# Altium schematic sheet main.SchDoc
size A4
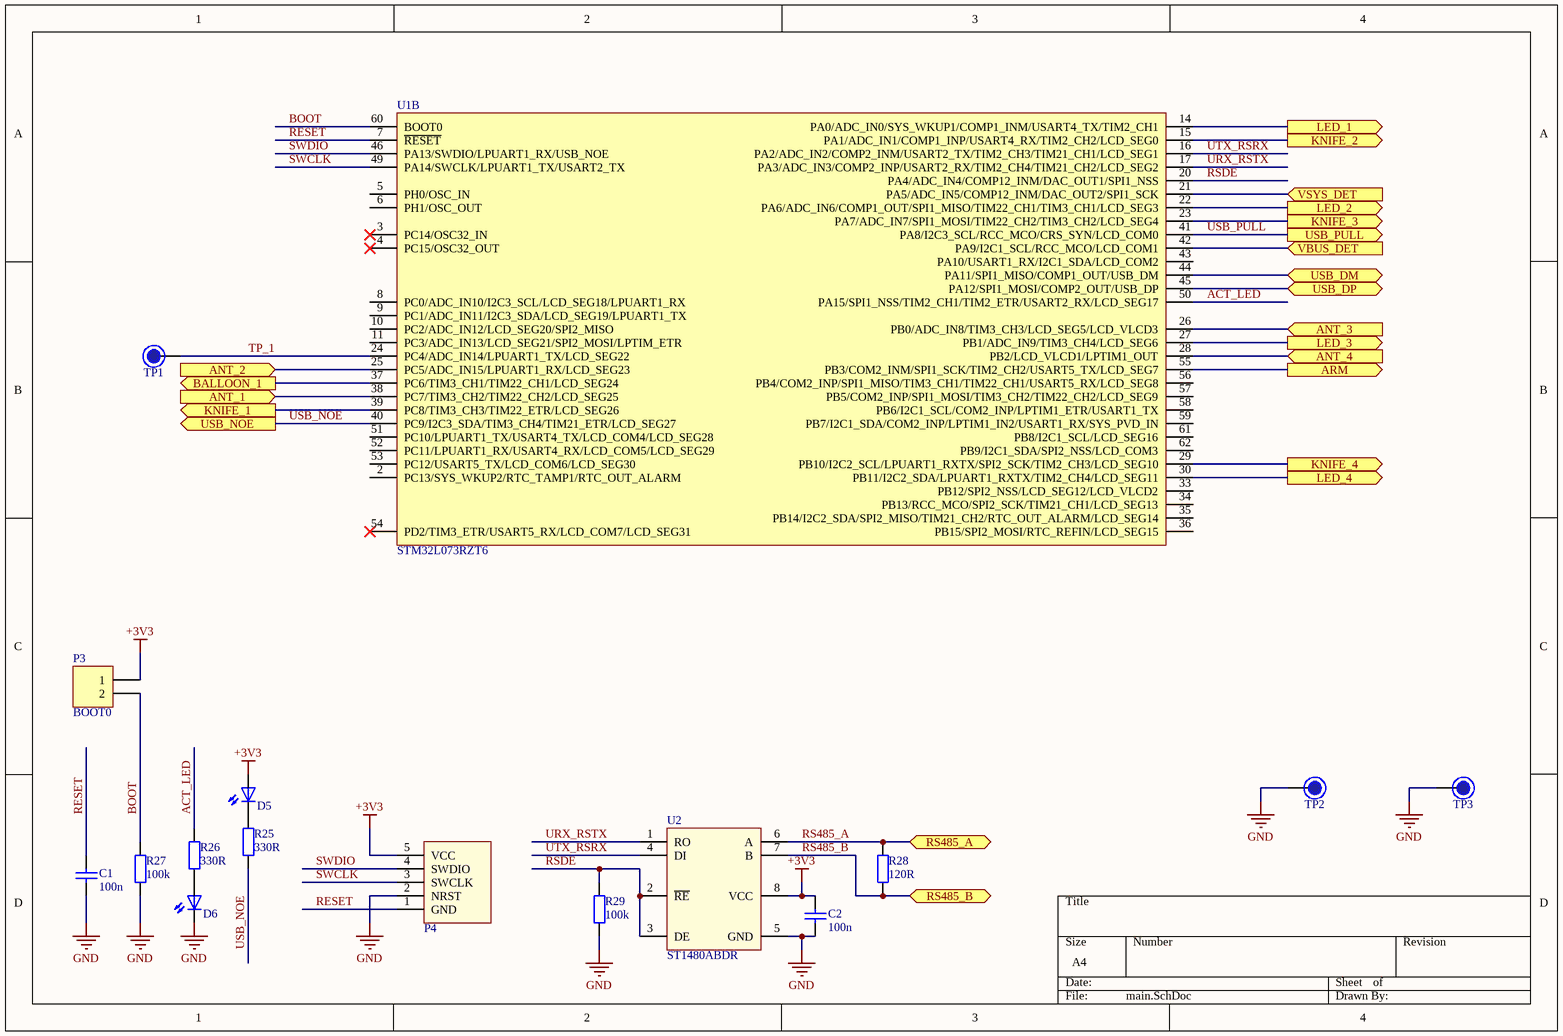
[diagram p0: main.SchDoc]

## Parts
C1  100n  [C0603_IPC_MD]
C2  100n  [C0603_IPC_MD]
D5  LTST-C190GKT  [LED_0603]  (value not drawn)
D6  LTST-C190GKT  [LED_0603]  (value not drawn)
P3  BOOT0  [HDR1X2]  (no BOM)
P4  SWD  [SWD_CON_VAR2]  (value not drawn)  (no BOM)
R25  330R  [R0603_IPC_MD]
R26  330R  [R0603_IPC_MD]
R27  100k  [R0603_IPC_MD]
R28  120R  [R0603_IPC_MD]
R29  100k  [R0603_IPC_MD]
TP1  Test Point  [TestPoint_1M5]  (value not drawn)  (no BOM)
TP2  GND  [TestPoint_1M5_TH]  (value not drawn)  (no BOM)
TP3  GND  [TestPoint_1M5_TH]  (value not drawn)  (no BOM)
U1  STM32L073RZT6  [LQFP64_10X10MM]  (part B of 2)
U2  ST1480ABDR  [SOIC-8]

## Ports
ANT_1 (in), ANT_2 (in), ANT_3 (in), ANT_4 (in), ARM (out), BALLOON_1 (out), KNIFE_1 (out), KNIFE_2 (out), KNIFE_3 (out), KNIFE_4 (out), LED_1 (out), LED_2 (out), LED_3 (out), LED_4 (out), RS485_A (bidir), RS485_B (bidir), USB_DM (bidir), USB_DP (bidir), USB_NOE (out), USB_PULL (out), VBUS_DET (in), VSYS_DET (in)

## Nets
+3V3: C2.2 D5.2(A) P3.1 P4.5(VCC) U2.8(VCC)
GND: C1.1 C2.1 D6.1(C) P4.2(NRST) R27.1 R29.1 TP2.0 TP3.0 U2.5(GND)
ACT_LED: R26.1 U1.50(PA15/SPI1_NSS/TIM2_CH1/TIM2_ETR/USART2_RX/LCD_SEG17)
ANT_1: U1.38(PC7/TIM3_CH2/TIM22_CH2/LCD_SEG25) ; port ANT_1
ANT_2: U1.25(PC5/ADC_IN15/LPUART1_RX/LCD_SEG23) ; port ANT_2
ANT_3: U1.26(PB0/ADC_IN8/TIM3_CH3/LCD_SEG5/LCD_VLCD3) ; port ANT_3
ANT_4: U1.28(PB2/LCD_VLCD1/LPTIM1_OUT) ; port ANT_4
ARM: U1.55(PB3/COM2_INM/SPI1_SCK/TIM2_CH2/USART5_TX/LCD_SEG7) ; port ARM
BALLOON_1: U1.37(PC6/TIM3_CH1/TIM22_CH1/LCD_SEG24) ; port BALLOON_1
BOOT: P3.2 R27.2 U1.60(BOOT0)
KNIFE_1: U1.39(PC8/TIM3_CH3/TIM22_ETR/LCD_SEG26) ; port KNIFE_1
KNIFE_2: U1.15(PA1/ADC_IN1/COMP1_INP/USART4_RX/TIM2_CH2/LCD_SEG0) ; port KNIFE_2
KNIFE_3: U1.23(PA7/ADC_IN7/SPI1_MOSI/TIM22_CH2/TIM3_CH2/LCD_SEG4) ; port KNIFE_3
KNIFE_4: U1.29(PB10/I2C2_SCL/LPUART1_RXTX/SPI2_SCK/TIM2_CH3/LCD_SEG10) ; port KNIFE_4
LED_1: U1.14(PA0/ADC_IN0/SYS_WKUP1/COMP1_INM/USART4_TX/TIM2_CH1) ; port LED_1
LED_2: U1.22(PA6/ADC_IN6/COMP1_OUT/SPI1_MISO/TIM22_CH1/TIM3_CH1/LCD_SEG3) ; port LED_2
LED_3: U1.27(PB1/ADC_IN9/TIM3_CH4/LCD_SEG6) ; port LED_3
LED_4: U1.30(PB11/I2C2_SDA/LPUART1_RXTX/TIM2_CH4/LCD_SEG11) ; port LED_4
RESET: C1.2 P4.1(GND) U1.7(~{RESET})
RS485_A: R28.2 U2.6(A) ; port RS485_A
RS485_B: R28.1 U2.7(B) ; port RS485_B
RSDE: R29.2 U1.20(PA4/ADC_IN4/COMP12_INM/DAC_OUT1/SPI1_NSS) U2.2(~{RE}) U2.3(DE)
SWCLK: P4.3(SWCLK) U1.49(PA14/SWCLK/LPUART1_TX/USART2_TX)
SWDIO: P4.4(SWDIO) U1.46(PA13/SWDIO/LPUART1_RX/USB_NOE)
TP_1: TP1.0 U1.24(PC4/ADC_IN14/LPUART1_TX/LCD_SEG22)
URX_RSTX: U1.17(PA3/ADC_IN3/COMP2_INP/USART2_RX/TIM2_CH4/TIM21_CH2/LCD_SEG2) U2.1(RO)
USB_DM: U1.44(PA11/SPI1_MISO/COMP1_OUT/USB_DM) ; port USB_DM
USB_DP: U1.45(PA12/SPI1_MOSI/COMP2_OUT/USB_DP) ; port USB_DP
USB_NOE: R25.2 U1.40(PC9/I2C3_SDA/TIM3_CH4/TIM21_ETR/LCD_SEG27) ; port USB_NOE
USB_PULL: U1.41(PA8/I2C3_SCL/RCC_MCO/CRS_SYN/LCD_COM0) ; port USB_PULL
UTX_RSRX: U1.16(PA2/ADC_IN2/COMP2_INM/USART2_TX/TIM2_CH3/TIM21_CH1/LCD_SEG1) U2.4(DI)
VBUS_DET: U1.42(PA9/I2C1_SCL/RCC_MCO/LCD_COM1) ; port VBUS_DET
VSYS_DET: U1.21(PA5/ADC_IN5/COMP12_INM/DAC_OUT2/SPI1_SCK) ; port VSYS_DET
NetD5_1: D5.1(C) R25.1
NetD6_2: D6.2(A) R26.2

Not connected (* = marked no-connect by the designer): U1 2(PC13/SYS_WKUP2/RTC_TAMP1/RTC_OUT_ALARM) 3(PC14/OSC32_IN)* 4(PC15/OSC32_OUT)* 5(PH0/OSC_IN) 6(PH1/OSC_OUT) 8(PC0/ADC_IN10/I2C3_SCL/LCD_SEG18/LPUART1_RX) 9(PC1/ADC_IN11/I2C3_SDA/LCD_SEG19/LPUART1_TX) 10(PC2/ADC_IN12/LCD_SEG20/SPI2_MISO) 11(PC3/ADC_IN13/LCD_SEG21/SPI2_MOSI/LPTIM_ETR) 33(PB12/SPI2_NSS/LCD_SEG12/LCD_VLCD2) 34(PB13/RCC_MCO/SPI2_SCK/TIM21_CH1/LCD_SEG13) 35(PB14/I2C2_SDA/SPI2_MISO/TIM21_CH2/RTC_OUT_ALARM/LCD_SEG14) 36(PB15/SPI2_MOSI/RTC_REFIN/LCD_SEG15) 43(PA10/USART1_RX/I2C1_SDA/LCD_COM2) 51(PC10/LPUART1_TX/USART4_TX/LCD_COM4/LCD_SEG28) 52(PC11/LPUART1_RX/USART4_RX/LCD_COM5/LCD_SEG29) 53(PC12/USART5_TX/LCD_COM6/LCD_SEG30) 54(PD2/TIM3_ETR/USART5_RX/LCD_COM7/LCD_SEG31)* 56(PB4/COM2_INP/SPI1_MISO/TIM3_CH1/TIM22_CH1/USART5_RX/LCD_SEG8) 57(PB5/COM2_INP/SPI1_MOSI/TIM3_CH2/TIM22_CH2/LCD_SEG9) 58(PB6/I2C1_SCL/COM2_INP/LPTIM1_ETR/USART1_TX) 59(PB7/I2C1_SDA/COM2_INP/LPTIM1_IN2/USART1_RX/SYS_PVD_IN) 61(PB8/I2C1_SCL/LCD_SEG16) 62(PB9/I2C1_SDA/SPI2_NSS/LCD_COM3)

## Library data of the parts
C1 C2 = CL10B104KO8NNNC: CAP CER 0.1UF 16V X7R 0603; Manufacturer: Samsung Electro-Mechanics; Manufacturer Part Number: CL10B104KO8NNNC; Voltage: 16V; Value: 100n; Dielectric: X7R; Supplier 1: Digi-Key; Supplier Part Number 1: 1276-1005-1-ND
D5 D6 = LTST-C190GKT: LED GREEN CLEAR CHIP SMD 0603; Manufacturer: Lite-On Inc.; Manufacturer Part Number: LTST-C190GKT; Color: Green; Supplier 1: Digi-Key; Supplier Part Number 1: 160-1183-1-ND
P3 = Header 2: Header, 2-Pin; LatestRevisionDate: 17-Jul-2002; LatestRevisionNote: Re-released for DXP Platform.; Publisher: Altium Limited
P4 = SWD-CONNECTOR_VAR1: SWDIO SWCLK VDD GND NRST; Manufacturer: *; Manufacturer Part Number: *; Supplier 1: *; Supplier Part Number 1: *
R25 R26 = CR0603-JW-331ELF: RES SMD 330 OHM 5% 1/10W 0603; Manufacturer: Bourns Inc.; Value: 330R; Tolarance: 5%; Manufacturer Part Number: CR0603-JW-331ELF; Supplier 1: Digi-Key; Supplier Part Number 1: CR0603-JW-331ELFCT-ND
R27 R29 = RMCF0603FT100K: RES 100K OHM 1% 1/10W 0603; Manufacturer: Bourns Inc.; Value: 100k; Tolarance: 1%; Manufacturer Part Number: RMCF0603FT100K; Supplier 1: Digi-Key; Supplier Part Number 1: RMCF0603FT100KCT-ND
R28 = RC0603JR-07120RL: RES SMD 120 OHM 5% 1/10W 0603; Manufacturer: Yageo; Value: 120R; Tolarance: 5%; Manufacturer Part Number: RC0603JR-07120RL; Supplier 1: Digi-Key; Supplier Part Number 1: 311-120GRCT-ND
TP1 = TP
TP2 TP3 = TP: Test Point
U1 = STM32L073RZT6: Ultra-low-power 32-bit MCU ARM®-based Cortex®-M0+; Manufacturer: ST; SRAM: 20KB; FLASH: 192KB; Manufacturer Part Number: STM32L073RZT6; Supplier 1: Digi-Key; Supplier Part Number 1: 497-16270-ND
U2 = ST1480ABDR: IC TXRX 3.3V RS485/422 8 SOIC; Manufacturer: STMicroelectronics; Manufacturer Part Number: ST1480ABDR; Supplier 1: Digi-Key; Supplier Part Number 1: 497-2046-1-ND